# Altium schematic sheet PWR.SchDoc
size A4; SheetNumber: 2; SheetTotal: 4
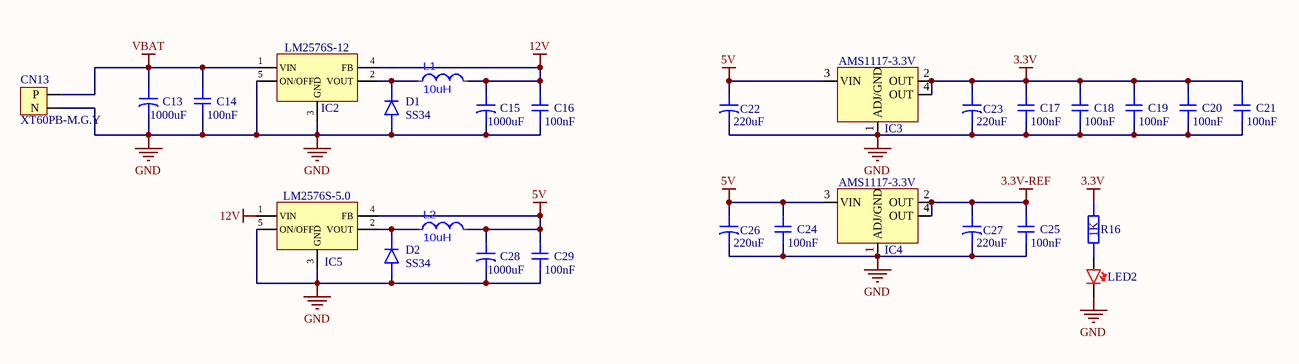
[diagram p0: PWR.SchDoc]

## Parts
C13  1000uF  [Plugin,D10xL20mm]
C14  100nF  [CAP-0603-2]
C15  1000uF  [Plugin,D10xL20mm]
C16  100nF  [CAP-0603-2]
C17  100nF  [CAP-0603-2]
C18  100nF  [CAP-0603-2]
C19  100nF  [CAP-0603-2]
C20  100nF  [CAP-0603-2]
C21  100nF  [CAP-0603-2]
C22  220uF  [PLUGIN,D6.3xL12mm]
C23  220uF  [PLUGIN,D6.3xL12mm]
C24  100nF  [CAP-0603-2]
C25  100nF  [CAP-0603-2]
C26  220uF  [PLUGIN,D6.3xL12mm]
C27  220uF  [PLUGIN,D6.3xL12mm]
C28  1000uF  [Plugin,D10xL20mm]
C29  100nF  [CAP-0603-2]
CN13  XT60PB-M.G.Y  [XT60PB-M.G.Y]
D1  SS34  [SMA(DO-214AC)]
D2  SS34  [SMA(DO-214AC)]
IC2  LM2576S-12  [TO-263-5L]
IC3  AMS1117-3.3V  [SOT-223]
IC4  AMS1117-3.3V  [SOT-223]
IC5  LM2576S-5.0  [TO-263-5L]
L1  10uH  [Inductor 4.5A 10uH 0630]
L2  10uH  [Inductor 4.5A 10uH 0630]
LED2  RED  [LED-0603]  (value not drawn)
R16  1K  [RES-0603-1]

## Nets
3.3V: C17.1 C18.1 C19.1 C20.1 C21.1 C23.1 IC3.2(OUT) IC3.4(OUT) R16.2
3.3V-REF: C25.1 C27.1 IC4.2(OUT) IC4.4(OUT)
5V: C22.1 C24.1 C26.1 C28.1 C29.1 IC3.3(VIN) IC4.3(VIN) IC5.4(FB) L2.2
12V: C15.1 C16.1 IC2.4(FB) IC5.1(VIN) L1.2
GND: C13.2 C14.2 C15.2 C16.2 C17.2 C18.2 C19.2 C20.2 C21.2 C22.2 C23.2 C24.2 C25.2 C26.2 C27.2 C28.2 C29.2 CN13.2(N) D1.1(A) D2.1(A) IC2.3(GND) IC2.5(ON/OFF) IC3.1(ADJ/GND) IC4.1(ADJ/GND) IC5.3(GND) IC5.5(ON/OFF) LED2.2(K)
VBAT: C13.1 C14.1 CN13.1(P) IC2.1(VIN)
NetD1_2: D1.2(K) IC2.2(VOUT) L1.1
NetD2_2: D2.2(K) IC5.2(VOUT) L2.1
NetLED2_1: LED2.1(A) R16.1

## Notes on the sheet
- Title:
- Size:
- Date:
- Project:
- A4
- Sheet
- of
- File:
- D:\1_ALTIUM

## Library data of the parts
C13 C15 C28 = 35PX1000MEFC10X20: 1000uF 35V Aluminum Electrolytic Capacitors Through Hole,D10xL20mm 2000hrs@105℃; Manufacturer: Rubycon; So_Chan_Cam: 2; Mfr.Part #: 35PX1000MEFC10X20; LCSC Part #: C136014; Package: Through Hole,D10xL20mm; DigiKey Part Number: 1189-1745-ND; ComponentLink1Description: Link; ComponentLink1URL: https://www.lcsc.com/product-detail/C136014.html?s_z=n_35PX1000MEFC10X20; ComponentLink2Description: Link 1; ComponentLink2URL: https://www.digikey.com/en/products/detail/rubycon/35PX1000MEFC10X20/3563769?s=N4IgTCBcDaIMwFYAKANAjABiwWQKIDEBhTFMDEAXQF8g
C14 C16-C21 C24 C25 C29 = CL10B104KB8NNNC: 100nF ±10% 50V Ceramic Capacitor X7R 0603; Manufacturer: Samsung Electro-Mechanics; Package: 0603; LCSC Part #: C1591; Mfr.Part #: CL10B104KB8NNNC; DigiKey Part Number: 1276-1000-2-ND; ComponentLink1Description: Link; ComponentLink1URL: https://www.lcsc.com/product-detail/C1591.html?s_z=n_CL10B104KB8NNC; ComponentLink2Description: Link 1; ComponentLink2URL: https://www.digikey.com/en/products/detail/samsung-electro-mechanics/CL10B104KB8NNNC/3886658?s=N4IgTCBcDaIMIBkCMAGAQqgLAaTQDgDki4QBdAXyA
C22 C23 C26 C27 = 25YXJ220M6.3X11: 220uF 25V Aluminum Electrolytic Capacitors Through Hole,D6.3xL11mm 7000hrs@105℃; Manufacturer: Rubycon; Mfr.Part #: 25YXJ220M6.3X11; Package: Through Hole,D6.3xL11mm; LCSC Part #: C88729; DigiKey Part Number: 1189-2913-ND; ComponentLink1Description: Link; ComponentLink1URL: https://www.lcsc.com/product-detail/C88729.html; ComponentLink2Description: Link 1; ComponentLink2URL: https://www.digikey.com/en/products/detail/rubycon/25YXJ220M6-3X11/3563124?s=N4IgTCBcDa4KwE0AaApMYAMBZAbAOgGYkBGYkAXQF8g
CN13 = XT60PB-M.G.Y: Power Connectors RoHS; Manufacturer: Changzhou Amass Elec; Mfr.Part #: XT60PB-M.G.Y; LCSC Part #: C19268037; Package: Through Hole; DigiKey Part Number: NO; ComponentLink1Description: Link; ComponentLink1URL: https://www.lcsc.com/product-detail/C19268037.html?s_z=n_xt60; ComponentLink2Description: Link 1
D1 D2 = SS34: Diode Independent 40V 3A Surface Mount SMA(DO-214AC); Manufacturer: GOODWORK; Mfr.Part #: SS34; Package: SMA(DO-214AC); LCSC Part #: C908680; DigiKey Part Number: NO; ComponentLink1Description: Link; ComponentLink1URL: https://www.lcsc.com/product-detail/C908680.html?s_z=n_C908680
IC2 = LM2576S-12: Buck Switching Regulator IC Fixed 12V 1 Output 3A TO-263-5L; Manufacturer: HXY MOSFET; Mfr.Part #: LM2576S-12; Package: TO-263-5L; LCSC Part #: C22386541; DigiKey Part Number: NO
IC3 IC4 = AMS1117-3.3V: Linear Voltage Regulator IC Positive Fixed 1 Output 1A SOT-223; Manufacturer: MSKSEMI; Mfr.Part #: AMS1117-3.3V; Package: SOT-223; LCSC Part #: C5120765; DigiKey Part Number: NO; ComponentLink1Description: Link; ComponentLink1URL: https://www.lcsc.com/product-detail/C5120765.html?s_z=n_C5120765
IC5 = LM2576S-5.0: 47kHz~58kHz Buck Adjustable 3.5A 5V TO-263-5L Voltage Regulators - DC DC Switching Regulators RoHS; Manufacturer: HXY MOSFET; Mfr.Part #: LM2576S-5.0; Package: TO-263-5L; LCSC Part #: C5349983; DigiKey Part Number: NO; ComponentLink1Description: Link; ComponentLink1URL: https://www.lcsc.com/product-detail/C5349983.html?s_z=n_LM2576S-5.0; ComponentLink2Description: Link 1
L1 L2 = Inductor 4.5A 10uH 0630: 4.5A 10uH ±20% 5.5A 68mΩ Molded Inductor SMD,7.3x6.6mm Fixed Inductors RoHS; Manufacturer: Shun Xiang Nuo; MPN: SMMS0630-100M; Key Attributes: FIXED IND 10uH 68mΩ SMD,6.6x7.3mm; ComponentLink1Description: Link; ComponentLink1URL: https://www.lcsc.com/product-detail/C128692.html?s_z=n_q_l_inductor%25200630&spm=wm.fly.bg.1.xh___wm.fly.tp.0.ml&lcsc_vid=Q1VfX1ReRFFaUFJSRgIIUV0CFFgIBFJfT1hdVlwEEVkxVlNRTlNdX1VST1JcVTsOAxUeFF5JWBYZEEoKFBINSQcJGk4%3D; LCSC Part #: C128692; Packaging: SMD,7.3x6.6mm; Link: https://www.lcsc.com/product-detail/C128692.html?s_z=n_q_l_inductor%25200630&spm=wm.fly.bg.1.xh___wm.fly.tp.0.ml&lcsc_vid=Q1VfX1ReRFFaUFJSRgIIUV0CFFgIBFJfT1hdVlwEEVkxVlNRTlNdX1VST1JcVTsOAxUeFF5JWBYZEEoKFBINSQcJGk4%3D; Parameter 7: *
LED2 = YLED0603R: 25mA 1.8V~2.4V Red 0603 LED Indication - Discrete ROHS; Manufacturer: YONGYUTAI; Mfr.Part #: YLED0603R; Package: 0603; LCSC Part #: C19171390; DigiKey Part Number: NO; ComponentLink1Description: Link; ComponentLink1URL: https://www.lcsc.com/product-detail/C19171390.html?s_z=n_C19171390; ComponentLink2Description: Link 1
R16 = RC0603FR-071KL: 100mW 1kΩ 75V Thick Film Resistor ±100ppm/℃ ±1% 0603 Chip Resistor - Surface Mount RoHS; Manufacturer: YAGEO; Mfr.Part #: RC0603FR-071KL; Package: 0603; LCSC Part #: C22548; DigiKey Part Number: 311-1.00KHRTR-ND; ComponentLink1Description: Link; ComponentLink1URL: https://www.lcsc.com/product-detail/C22548.html?s_z=n_C22548; ComponentLink2Description: Link 1; ComponentLink2URL: https://www.digikey.com/en/products/detail/yageo/RC0603FR-071KL/726843?s=N4IgTCBcDaIEoGEAMA2JBmAYnAtEg7AIwDSAMiALoC%2BQA